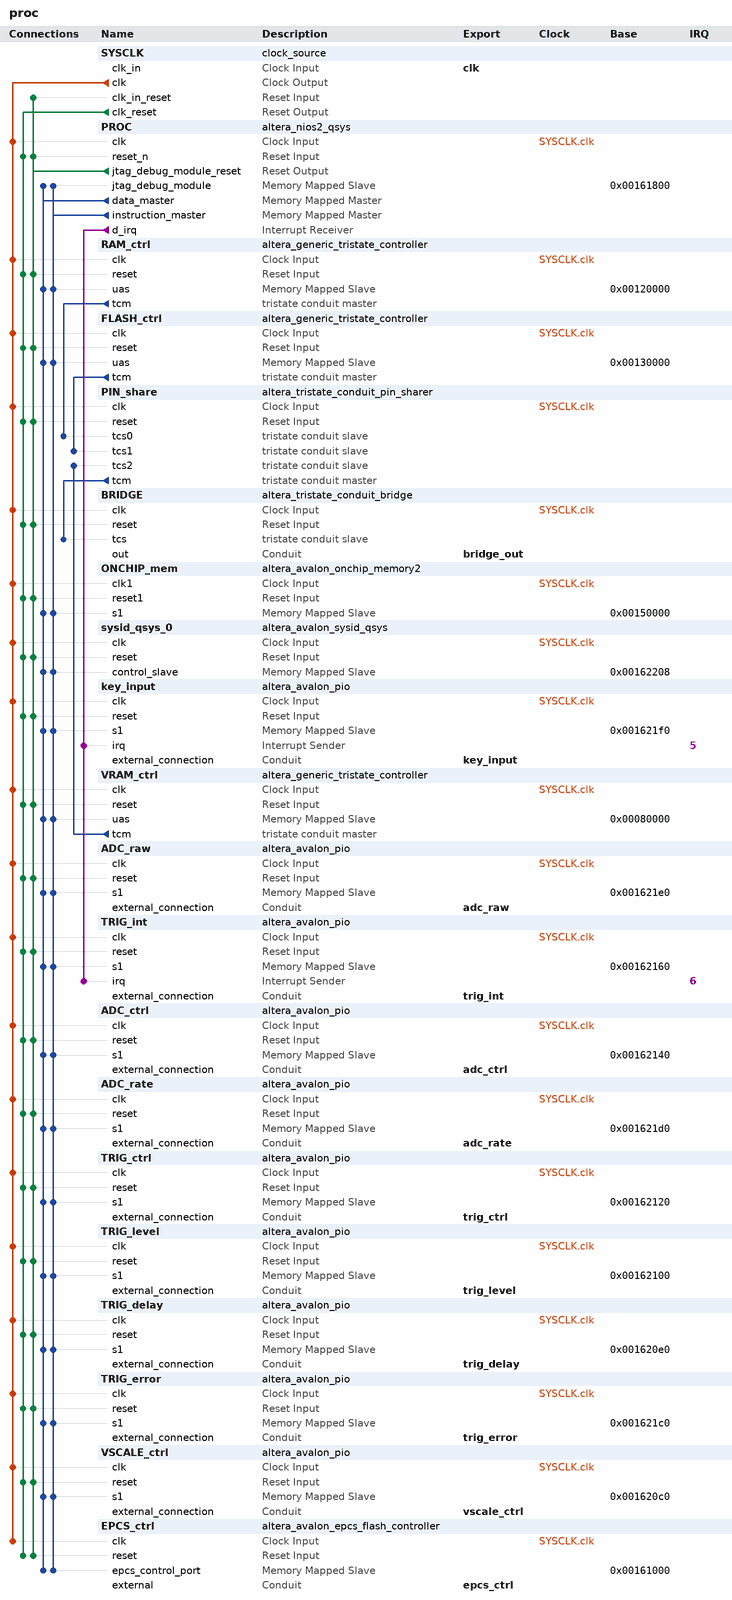
[diagram p0: system contents]
# Platform Designer (Qsys) system proc, Cyclone III EP3C25Q240C8
# Parameters at their usual value, and those the tool derives, are not listed.
package require -exact qsys 13.1
create_system proc
set_project_property DEVICE_FAMILY {Cyclone III}
set_project_property DEVICE EP3C25Q240C8

add_instance SYSCLK clock_source 13.1
set_instance_parameter_value SYSCLK clockFrequency 36000000

add_instance PROC altera_nios2_qsys 13.1
set_instance_parameter_value PROC muldiv_divider true
set_instance_parameter_value PROC resetSlave ONCHIP_mem.s1
set_instance_parameter_value PROC mmu_TLBMissExcSlave None
set_instance_parameter_value PROC exceptionSlave ONCHIP_mem.s1
set_instance_parameter_value PROC breakSlave PROC.jtag_debug_module
set_instance_parameter_value PROC impl Small
set_instance_parameter_value PROC icache_size 4096

add_instance RAM_ctrl altera_generic_tristate_controller 13.1
set_instance_parameter_value RAM_ctrl TCM_ADDRESS_W 16
set_instance_parameter_value RAM_ctrl TCM_DATA_W 8
set_instance_parameter_value RAM_ctrl TCM_BYTEENABLE_W 1
set_instance_parameter_value RAM_ctrl TCM_READ_WAIT 12
set_instance_parameter_value RAM_ctrl TCM_WRITE_WAIT 8
set_instance_parameter_value RAM_ctrl TCM_SETUP_WAIT 12
set_instance_parameter_value RAM_ctrl TCM_DATA_HOLD 0
set_instance_parameter_value RAM_ctrl TCM_MAX_PENDING_READ_TRANSACTIONS 1
set_instance_parameter_value RAM_ctrl TCM_TURNAROUND_TIME 1
set_instance_parameter_value RAM_ctrl TCM_TIMING_UNITS 0
set_instance_parameter_value RAM_ctrl TCM_READLATENCY 2
set_instance_parameter_value RAM_ctrl TCM_SYMBOLS_PER_WORD 1
set_instance_parameter_value RAM_ctrl USE_READ 0
set_instance_parameter_value RAM_ctrl USE_BEGINTRANSFER 0
set_instance_parameter_value RAM_ctrl USE_BYTEENABLE 0
set_instance_parameter_value RAM_ctrl USE_OUTPUTENABLE 0
set_instance_parameter_value RAM_ctrl ACTIVE_LOW_READ 0
set_instance_parameter_value RAM_ctrl ACTIVE_LOW_BYTEENABLE 0
set_instance_parameter_value RAM_ctrl ACTIVE_LOW_OUTPUTENABLE 0
set_instance_parameter_value RAM_ctrl ACTIVE_LOW_BEGINTRANSFER 0
set_instance_parameter_value RAM_ctrl CHIPSELECT_THROUGH_READLATENCY 0
set_instance_parameter_value RAM_ctrl MODULE_ASSIGNMENT_KEYS embeddedsw.configuration.hwClassnameDriverSupportList,embeddedsw.CMacro.SIZE
set_instance_parameter_value RAM_ctrl MODULE_ASSIGNMENT_VALUES altera_avalon_lan91c111:altera_avalon_idt_sram,65536
set_instance_parameter_value RAM_ctrl INTERFACE_ASSIGNMENT_KEYS embeddedsw.configuration.isMemoryDevice,embeddedsw.configuration.isFlash,embeddedsw.configuration.isNonVolatileStorage
set_instance_parameter_value RAM_ctrl INTERFACE_ASSIGNMENT_VALUES 1,0,0

add_instance FLASH_ctrl altera_generic_tristate_controller 13.1
set_instance_parameter_value FLASH_ctrl TCM_ADDRESS_W 16
set_instance_parameter_value FLASH_ctrl TCM_DATA_W 8
set_instance_parameter_value FLASH_ctrl TCM_BYTEENABLE_W 1
set_instance_parameter_value FLASH_ctrl TCM_READ_WAIT 8
set_instance_parameter_value FLASH_ctrl TCM_WRITE_WAIT 8
set_instance_parameter_value FLASH_ctrl TCM_SETUP_WAIT 4
set_instance_parameter_value FLASH_ctrl TCM_DATA_HOLD 4
set_instance_parameter_value FLASH_ctrl TCM_MAX_PENDING_READ_TRANSACTIONS 1
set_instance_parameter_value FLASH_ctrl TCM_TURNAROUND_TIME 2
set_instance_parameter_value FLASH_ctrl TCM_TIMING_UNITS 1
set_instance_parameter_value FLASH_ctrl TCM_READLATENCY 2
set_instance_parameter_value FLASH_ctrl TCM_SYMBOLS_PER_WORD 1
set_instance_parameter_value FLASH_ctrl USE_READ 0
set_instance_parameter_value FLASH_ctrl USE_BEGINTRANSFER 0
set_instance_parameter_value FLASH_ctrl USE_BYTEENABLE 0
set_instance_parameter_value FLASH_ctrl USE_OUTPUTENABLE 1
set_instance_parameter_value FLASH_ctrl ACTIVE_LOW_READ 0
set_instance_parameter_value FLASH_ctrl ACTIVE_LOW_BYTEENABLE 0
set_instance_parameter_value FLASH_ctrl ACTIVE_LOW_OUTPUTENABLE 1
set_instance_parameter_value FLASH_ctrl ACTIVE_LOW_BEGINTRANSFER 0
set_instance_parameter_value FLASH_ctrl CHIPSELECT_THROUGH_READLATENCY 0
set_instance_parameter_value FLASH_ctrl MODULE_ASSIGNMENT_KEYS embeddedsw.CMacro.SIZE,embeddedsw.memoryInfo.MEM_INIT_DATA_WIDTH,embeddedsw.memoryInfo.HAS_BYTE_LANE,embeddedsw.memoryInfo.IS_FLASH,embeddedsw.memoryInfo.GENERATE_DAT_SYM,embeddedsw.memoryInfo.GENERATE_FLASH,embeddedsw.memoryInfo.DAT_SYM_INSTALL_DIR,embeddedsw.memoryInfo.FLASH_INSTALL_DIR
set_instance_parameter_value FLASH_ctrl MODULE_ASSIGNMENT_VALUES 65536,8,0,1,1,1,SIM_DIR,APP_DIR
set_instance_parameter_value FLASH_ctrl INTERFACE_ASSIGNMENT_KEYS embeddedsw.configuration.isFlash,embeddedsw.configuration.isMemoryDevice,embeddedsw.configuration.isNonVolatileStorage
set_instance_parameter_value FLASH_ctrl INTERFACE_ASSIGNMENT_VALUES 1,1,1

add_instance PIN_share altera_tristate_conduit_pin_sharer 13.1
set_instance_parameter_value PIN_share NUM_INTERFACES 3
set_instance_parameter_value PIN_share MODULE_ORIGIN_LIST VRAM_ctrl.tcm,VRAM_ctrl.tcm,VRAM_ctrl.tcm,VRAM_ctrl.tcm,VRAM_ctrl.tcm,FLASH_ctrl.tcm,FLASH_ctrl.tcm,FLASH_ctrl.tcm,FLASH_ctrl.tcm,FLASH_ctrl.tcm,RAM_ctrl.tcm,RAM_ctrl.tcm,RAM_ctrl.tcm,RAM_ctrl.tcm
set_instance_parameter_value PIN_share SIGNAL_ORIGIN_LIST address,waitrequest,write_n,data,chipselect_n,address,outputenable_n,write_n,data,chipselect_n,address,write_n,data,chipselect_n
set_instance_parameter_value PIN_share SHARED_SIGNAL_LIST ,,,,,address,,r_w,data,,address,r_w,data

add_instance BRIDGE altera_tristate_conduit_bridge 13.1

add_instance ONCHIP_mem altera_avalon_onchip_memory2 13.1
set_instance_parameter_value ONCHIP_mem dataWidth 8
set_instance_parameter_value ONCHIP_mem dualPort false
set_instance_parameter_value ONCHIP_mem initMemContent true
set_instance_parameter_value ONCHIP_mem initializationFileName onchip_mem.hex
set_instance_parameter_value ONCHIP_mem memorySize 49152

add_instance sysid_qsys_0 altera_avalon_sysid_qsys 13.1
set_instance_parameter_value sysid_qsys_0 id -1431655766

add_instance key_input altera_avalon_pio 13.1
set_instance_parameter_value key_input bitClearingEdgeCapReg true
set_instance_parameter_value key_input captureEdge true
set_instance_parameter_value key_input direction Input
set_instance_parameter_value key_input generateIRQ true
set_instance_parameter_value key_input irqType EDGE
set_instance_parameter_value key_input width 20

add_instance VRAM_ctrl altera_generic_tristate_controller 13.1
set_instance_parameter_value VRAM_ctrl TCM_ADDRESS_W 19
set_instance_parameter_value VRAM_ctrl TCM_DATA_W 16
set_instance_parameter_value VRAM_ctrl TCM_BYTEENABLE_W 2
set_instance_parameter_value VRAM_ctrl TCM_READ_WAIT 0
set_instance_parameter_value VRAM_ctrl TCM_WRITE_WAIT 0
set_instance_parameter_value VRAM_ctrl TCM_SETUP_WAIT 0
set_instance_parameter_value VRAM_ctrl TCM_DATA_HOLD 0
set_instance_parameter_value VRAM_ctrl TCM_MAX_PENDING_READ_TRANSACTIONS 1
set_instance_parameter_value VRAM_ctrl TCM_TURNAROUND_TIME 2
set_instance_parameter_value VRAM_ctrl TCM_TIMING_UNITS 1
set_instance_parameter_value VRAM_ctrl TCM_READLATENCY 2
set_instance_parameter_value VRAM_ctrl TCM_SYMBOLS_PER_WORD 2
set_instance_parameter_value VRAM_ctrl USE_READ 0
set_instance_parameter_value VRAM_ctrl USE_BEGINTRANSFER 0
set_instance_parameter_value VRAM_ctrl USE_BYTEENABLE 0
set_instance_parameter_value VRAM_ctrl USE_WAITREQUEST 1
set_instance_parameter_value VRAM_ctrl USE_OUTPUTENABLE 0
set_instance_parameter_value VRAM_ctrl ACTIVE_LOW_READ 0
set_instance_parameter_value VRAM_ctrl ACTIVE_LOW_BYTEENABLE 0
set_instance_parameter_value VRAM_ctrl ACTIVE_LOW_OUTPUTENABLE 0
set_instance_parameter_value VRAM_ctrl ACTIVE_LOW_BEGINTRANSFER 0
set_instance_parameter_value VRAM_ctrl CHIPSELECT_THROUGH_READLATENCY 0
set_instance_parameter_value VRAM_ctrl MODULE_ASSIGNMENT_KEYS embeddedsw.configuration.hwClassnameDriverSupportList
set_instance_parameter_value VRAM_ctrl MODULE_ASSIGNMENT_VALUES "altera_avalon_lan91c111\\,altera_avalon_cfi_flash"

add_instance ADC_raw altera_avalon_pio 13.1
set_instance_parameter_value ADC_raw direction Input
set_instance_parameter_value ADC_raw width 24

add_instance TRIG_int altera_avalon_pio 13.1
set_instance_parameter_value TRIG_int bitClearingEdgeCapReg true
set_instance_parameter_value TRIG_int bitModifyingOutReg true
set_instance_parameter_value TRIG_int captureEdge true
set_instance_parameter_value TRIG_int direction Input
set_instance_parameter_value TRIG_int generateIRQ true
set_instance_parameter_value TRIG_int irqType EDGE
set_instance_parameter_value TRIG_int width 8

add_instance ADC_ctrl altera_avalon_pio 13.1
set_instance_parameter_value ADC_ctrl bitModifyingOutReg true
set_instance_parameter_value ADC_ctrl direction Output
set_instance_parameter_value ADC_ctrl width 8

add_instance ADC_rate altera_avalon_pio 13.1
set_instance_parameter_value ADC_rate direction Output
set_instance_parameter_value ADC_rate width 24

add_instance TRIG_ctrl altera_avalon_pio 13.1
set_instance_parameter_value TRIG_ctrl bitModifyingOutReg true
set_instance_parameter_value TRIG_ctrl direction Output
set_instance_parameter_value TRIG_ctrl width 8

add_instance TRIG_level altera_avalon_pio 13.1
set_instance_parameter_value TRIG_level bitModifyingOutReg true
set_instance_parameter_value TRIG_level direction Output
set_instance_parameter_value TRIG_level width 8

add_instance TRIG_delay altera_avalon_pio 13.1
set_instance_parameter_value TRIG_delay bitModifyingOutReg true
set_instance_parameter_value TRIG_delay direction Output
set_instance_parameter_value TRIG_delay width 16

add_instance TRIG_error altera_avalon_pio 13.1
set_instance_parameter_value TRIG_error direction Output
set_instance_parameter_value TRIG_error width 8

add_instance VSCALE_ctrl altera_avalon_pio 13.1
set_instance_parameter_value VSCALE_ctrl bitModifyingOutReg true
set_instance_parameter_value VSCALE_ctrl direction Output
set_instance_parameter_value VSCALE_ctrl width 8

add_instance EPCS_ctrl altera_avalon_epcs_flash_controller 13.1

# connections
add_connection SYSCLK.clk ADC_ctrl.clk clock
add_connection SYSCLK.clk ADC_rate.clk clock
add_connection SYSCLK.clk ADC_raw.clk clock
add_connection SYSCLK.clk BRIDGE.clk clock
add_connection SYSCLK.clk EPCS_ctrl.clk clock
add_connection SYSCLK.clk FLASH_ctrl.clk clock
add_connection SYSCLK.clk key_input.clk clock
add_connection SYSCLK.clk ONCHIP_mem.clk1 clock
add_connection SYSCLK.clk PIN_share.clk clock
add_connection SYSCLK.clk PROC.clk clock
add_connection SYSCLK.clk RAM_ctrl.clk clock
add_connection SYSCLK.clk sysid_qsys_0.clk clock
add_connection SYSCLK.clk TRIG_ctrl.clk clock
add_connection SYSCLK.clk TRIG_delay.clk clock
add_connection SYSCLK.clk TRIG_error.clk clock
add_connection SYSCLK.clk TRIG_int.clk clock
add_connection SYSCLK.clk TRIG_level.clk clock
add_connection SYSCLK.clk VRAM_ctrl.clk clock
add_connection SYSCLK.clk VSCALE_ctrl.clk clock
add_connection PROC.jtag_debug_module_reset ADC_ctrl.reset reset
add_connection PROC.jtag_debug_module_reset ADC_rate.reset reset
add_connection PROC.jtag_debug_module_reset ADC_raw.reset reset
add_connection PROC.jtag_debug_module_reset BRIDGE.reset reset
add_connection PROC.jtag_debug_module_reset EPCS_ctrl.reset reset
add_connection PROC.jtag_debug_module_reset FLASH_ctrl.reset reset
add_connection PROC.jtag_debug_module_reset key_input.reset reset
add_connection PROC.jtag_debug_module_reset ONCHIP_mem.reset1 reset
add_connection PROC.jtag_debug_module_reset PIN_share.reset reset
add_connection PROC.jtag_debug_module_reset PROC.reset_n reset
add_connection PROC.jtag_debug_module_reset RAM_ctrl.reset reset
add_connection PROC.jtag_debug_module_reset SYSCLK.clk_in_reset reset
add_connection PROC.jtag_debug_module_reset sysid_qsys_0.reset reset
add_connection PROC.jtag_debug_module_reset TRIG_ctrl.reset reset
add_connection PROC.jtag_debug_module_reset TRIG_delay.reset reset
add_connection PROC.jtag_debug_module_reset TRIG_error.reset reset
add_connection PROC.jtag_debug_module_reset TRIG_int.reset reset
add_connection PROC.jtag_debug_module_reset TRIG_level.reset reset
add_connection PROC.jtag_debug_module_reset VRAM_ctrl.reset reset
add_connection PROC.jtag_debug_module_reset VSCALE_ctrl.reset reset
add_connection SYSCLK.clk_reset ADC_ctrl.reset reset
add_connection SYSCLK.clk_reset ADC_rate.reset reset
add_connection SYSCLK.clk_reset ADC_raw.reset reset
add_connection SYSCLK.clk_reset BRIDGE.reset reset
add_connection SYSCLK.clk_reset EPCS_ctrl.reset reset
add_connection SYSCLK.clk_reset FLASH_ctrl.reset reset
add_connection SYSCLK.clk_reset key_input.reset reset
add_connection SYSCLK.clk_reset ONCHIP_mem.reset1 reset
add_connection SYSCLK.clk_reset PIN_share.reset reset
add_connection SYSCLK.clk_reset PROC.reset_n reset
add_connection SYSCLK.clk_reset RAM_ctrl.reset reset
add_connection SYSCLK.clk_reset sysid_qsys_0.reset reset
add_connection SYSCLK.clk_reset TRIG_ctrl.reset reset
add_connection SYSCLK.clk_reset TRIG_delay.reset reset
add_connection SYSCLK.clk_reset TRIG_error.reset reset
add_connection SYSCLK.clk_reset TRIG_int.reset reset
add_connection SYSCLK.clk_reset TRIG_level.reset reset
add_connection SYSCLK.clk_reset VRAM_ctrl.reset reset
add_connection SYSCLK.clk_reset VSCALE_ctrl.reset reset
add_connection PROC.data_master ADC_ctrl.s1 avalon
set_connection_parameter_value PROC.data_master/ADC_ctrl.s1 baseAddress 0x00162140
add_connection PROC.data_master ADC_rate.s1 avalon
set_connection_parameter_value PROC.data_master/ADC_rate.s1 baseAddress 0x001621d0
add_connection PROC.data_master ADC_raw.s1 avalon
set_connection_parameter_value PROC.data_master/ADC_raw.s1 baseAddress 0x001621e0
add_connection PROC.data_master EPCS_ctrl.epcs_control_port avalon
set_connection_parameter_value PROC.data_master/EPCS_ctrl.epcs_control_port baseAddress 0x00161000
add_connection PROC.data_master FLASH_ctrl.uas avalon
set_connection_parameter_value PROC.data_master/FLASH_ctrl.uas baseAddress 0x00130000
add_connection PROC.data_master key_input.s1 avalon
set_connection_parameter_value PROC.data_master/key_input.s1 baseAddress 0x001621f0
add_connection PROC.data_master ONCHIP_mem.s1 avalon
set_connection_parameter_value PROC.data_master/ONCHIP_mem.s1 baseAddress 0x00150000
add_connection PROC.data_master PROC.jtag_debug_module avalon
set_connection_parameter_value PROC.data_master/PROC.jtag_debug_module baseAddress 0x00161800
add_connection PROC.data_master RAM_ctrl.uas avalon
set_connection_parameter_value PROC.data_master/RAM_ctrl.uas baseAddress 0x00120000
add_connection PROC.data_master sysid_qsys_0.control_slave avalon
set_connection_parameter_value PROC.data_master/sysid_qsys_0.control_slave baseAddress 0x00162208
add_connection PROC.data_master TRIG_ctrl.s1 avalon
set_connection_parameter_value PROC.data_master/TRIG_ctrl.s1 baseAddress 0x00162120
add_connection PROC.data_master TRIG_delay.s1 avalon
set_connection_parameter_value PROC.data_master/TRIG_delay.s1 baseAddress 0x001620e0
add_connection PROC.data_master TRIG_error.s1 avalon
set_connection_parameter_value PROC.data_master/TRIG_error.s1 baseAddress 0x001621c0
add_connection PROC.data_master TRIG_int.s1 avalon
set_connection_parameter_value PROC.data_master/TRIG_int.s1 baseAddress 0x00162160
add_connection PROC.data_master TRIG_level.s1 avalon
set_connection_parameter_value PROC.data_master/TRIG_level.s1 baseAddress 0x00162100
add_connection PROC.data_master VRAM_ctrl.uas avalon
set_connection_parameter_value PROC.data_master/VRAM_ctrl.uas baseAddress 0x00080000
add_connection PROC.data_master VSCALE_ctrl.s1 avalon
set_connection_parameter_value PROC.data_master/VSCALE_ctrl.s1 baseAddress 0x001620c0
add_connection PROC.instruction_master ADC_ctrl.s1 avalon
set_connection_parameter_value PROC.instruction_master/ADC_ctrl.s1 baseAddress 0x00162140
add_connection PROC.instruction_master ADC_rate.s1 avalon
set_connection_parameter_value PROC.instruction_master/ADC_rate.s1 baseAddress 0x001621d0
add_connection PROC.instruction_master ADC_raw.s1 avalon
set_connection_parameter_value PROC.instruction_master/ADC_raw.s1 baseAddress 0x001621e0
add_connection PROC.instruction_master EPCS_ctrl.epcs_control_port avalon
set_connection_parameter_value PROC.instruction_master/EPCS_ctrl.epcs_control_port baseAddress 0x00161000
add_connection PROC.instruction_master FLASH_ctrl.uas avalon
set_connection_parameter_value PROC.instruction_master/FLASH_ctrl.uas baseAddress 0x00130000
add_connection PROC.instruction_master key_input.s1 avalon
set_connection_parameter_value PROC.instruction_master/key_input.s1 baseAddress 0x001621f0
add_connection PROC.instruction_master ONCHIP_mem.s1 avalon
set_connection_parameter_value PROC.instruction_master/ONCHIP_mem.s1 baseAddress 0x00150000
add_connection PROC.instruction_master PROC.jtag_debug_module avalon
set_connection_parameter_value PROC.instruction_master/PROC.jtag_debug_module baseAddress 0x00161800
add_connection PROC.instruction_master RAM_ctrl.uas avalon
set_connection_parameter_value PROC.instruction_master/RAM_ctrl.uas baseAddress 0x00120000
add_connection PROC.instruction_master sysid_qsys_0.control_slave avalon
set_connection_parameter_value PROC.instruction_master/sysid_qsys_0.control_slave baseAddress 0x00162208
add_connection PROC.instruction_master TRIG_ctrl.s1 avalon
set_connection_parameter_value PROC.instruction_master/TRIG_ctrl.s1 baseAddress 0x00162120
add_connection PROC.instruction_master TRIG_delay.s1 avalon
set_connection_parameter_value PROC.instruction_master/TRIG_delay.s1 baseAddress 0x001620e0
add_connection PROC.instruction_master TRIG_error.s1 avalon
set_connection_parameter_value PROC.instruction_master/TRIG_error.s1 baseAddress 0x001621c0
add_connection PROC.instruction_master TRIG_int.s1 avalon
set_connection_parameter_value PROC.instruction_master/TRIG_int.s1 baseAddress 0x00162160
add_connection PROC.instruction_master TRIG_level.s1 avalon
set_connection_parameter_value PROC.instruction_master/TRIG_level.s1 baseAddress 0x00162100
add_connection PROC.instruction_master VRAM_ctrl.uas avalon
set_connection_parameter_value PROC.instruction_master/VRAM_ctrl.uas baseAddress 0x00080000
add_connection PROC.instruction_master VSCALE_ctrl.s1 avalon
set_connection_parameter_value PROC.instruction_master/VSCALE_ctrl.s1 baseAddress 0x001620c0
add_connection PROC.d_irq key_input.irq interrupt
set_connection_parameter_value PROC.d_irq/key_input.irq irqNumber 5
add_connection PROC.d_irq TRIG_int.irq interrupt
set_connection_parameter_value PROC.d_irq/TRIG_int.irq irqNumber 6
add_connection FLASH_ctrl.tcm PIN_share.tcs1 tristate_conduit
add_connection PIN_share.tcm BRIDGE.tcs tristate_conduit
add_connection RAM_ctrl.tcm PIN_share.tcs0 tristate_conduit
add_connection VRAM_ctrl.tcm PIN_share.tcs2 tristate_conduit

# exported interfaces
add_interface clk clock sink
set_interface_property clk EXPORT_OF SYSCLK.clk_in
add_interface bridge_out conduit end
set_interface_property bridge_out EXPORT_OF BRIDGE.out
add_interface key_input conduit end
set_interface_property key_input EXPORT_OF key_input.external_connection
add_interface adc_raw conduit end
set_interface_property adc_raw EXPORT_OF ADC_raw.external_connection
add_interface trig_int conduit end
set_interface_property trig_int EXPORT_OF TRIG_int.external_connection
add_interface adc_ctrl conduit end
set_interface_property adc_ctrl EXPORT_OF ADC_ctrl.external_connection
add_interface adc_rate conduit end
set_interface_property adc_rate EXPORT_OF ADC_rate.external_connection
add_interface trig_ctrl conduit end
set_interface_property trig_ctrl EXPORT_OF TRIG_ctrl.external_connection
add_interface trig_level conduit end
set_interface_property trig_level EXPORT_OF TRIG_level.external_connection
add_interface trig_delay conduit end
set_interface_property trig_delay EXPORT_OF TRIG_delay.external_connection
add_interface trig_error conduit end
set_interface_property trig_error EXPORT_OF TRIG_error.external_connection
add_interface vscale_ctrl conduit end
set_interface_property vscale_ctrl EXPORT_OF VSCALE_ctrl.external_connection
add_interface epcs_ctrl conduit end
set_interface_property epcs_ctrl EXPORT_OF EPCS_ctrl.external

set_interconnect_requirement {$system} qsys_mm.clockCrossingAdapter HANDSHAKE
set_interconnect_requirement {$system} qsys_mm.maxAdditionalLatency 1
set_interconnect_requirement {$system} qsys_mm.insertDefaultSlave false

save_system proc.qsys
